# EAGLE schematic LPC_4TE_TOP_3_53c (EAGLE 5.04)

## Sheet 1 of 2
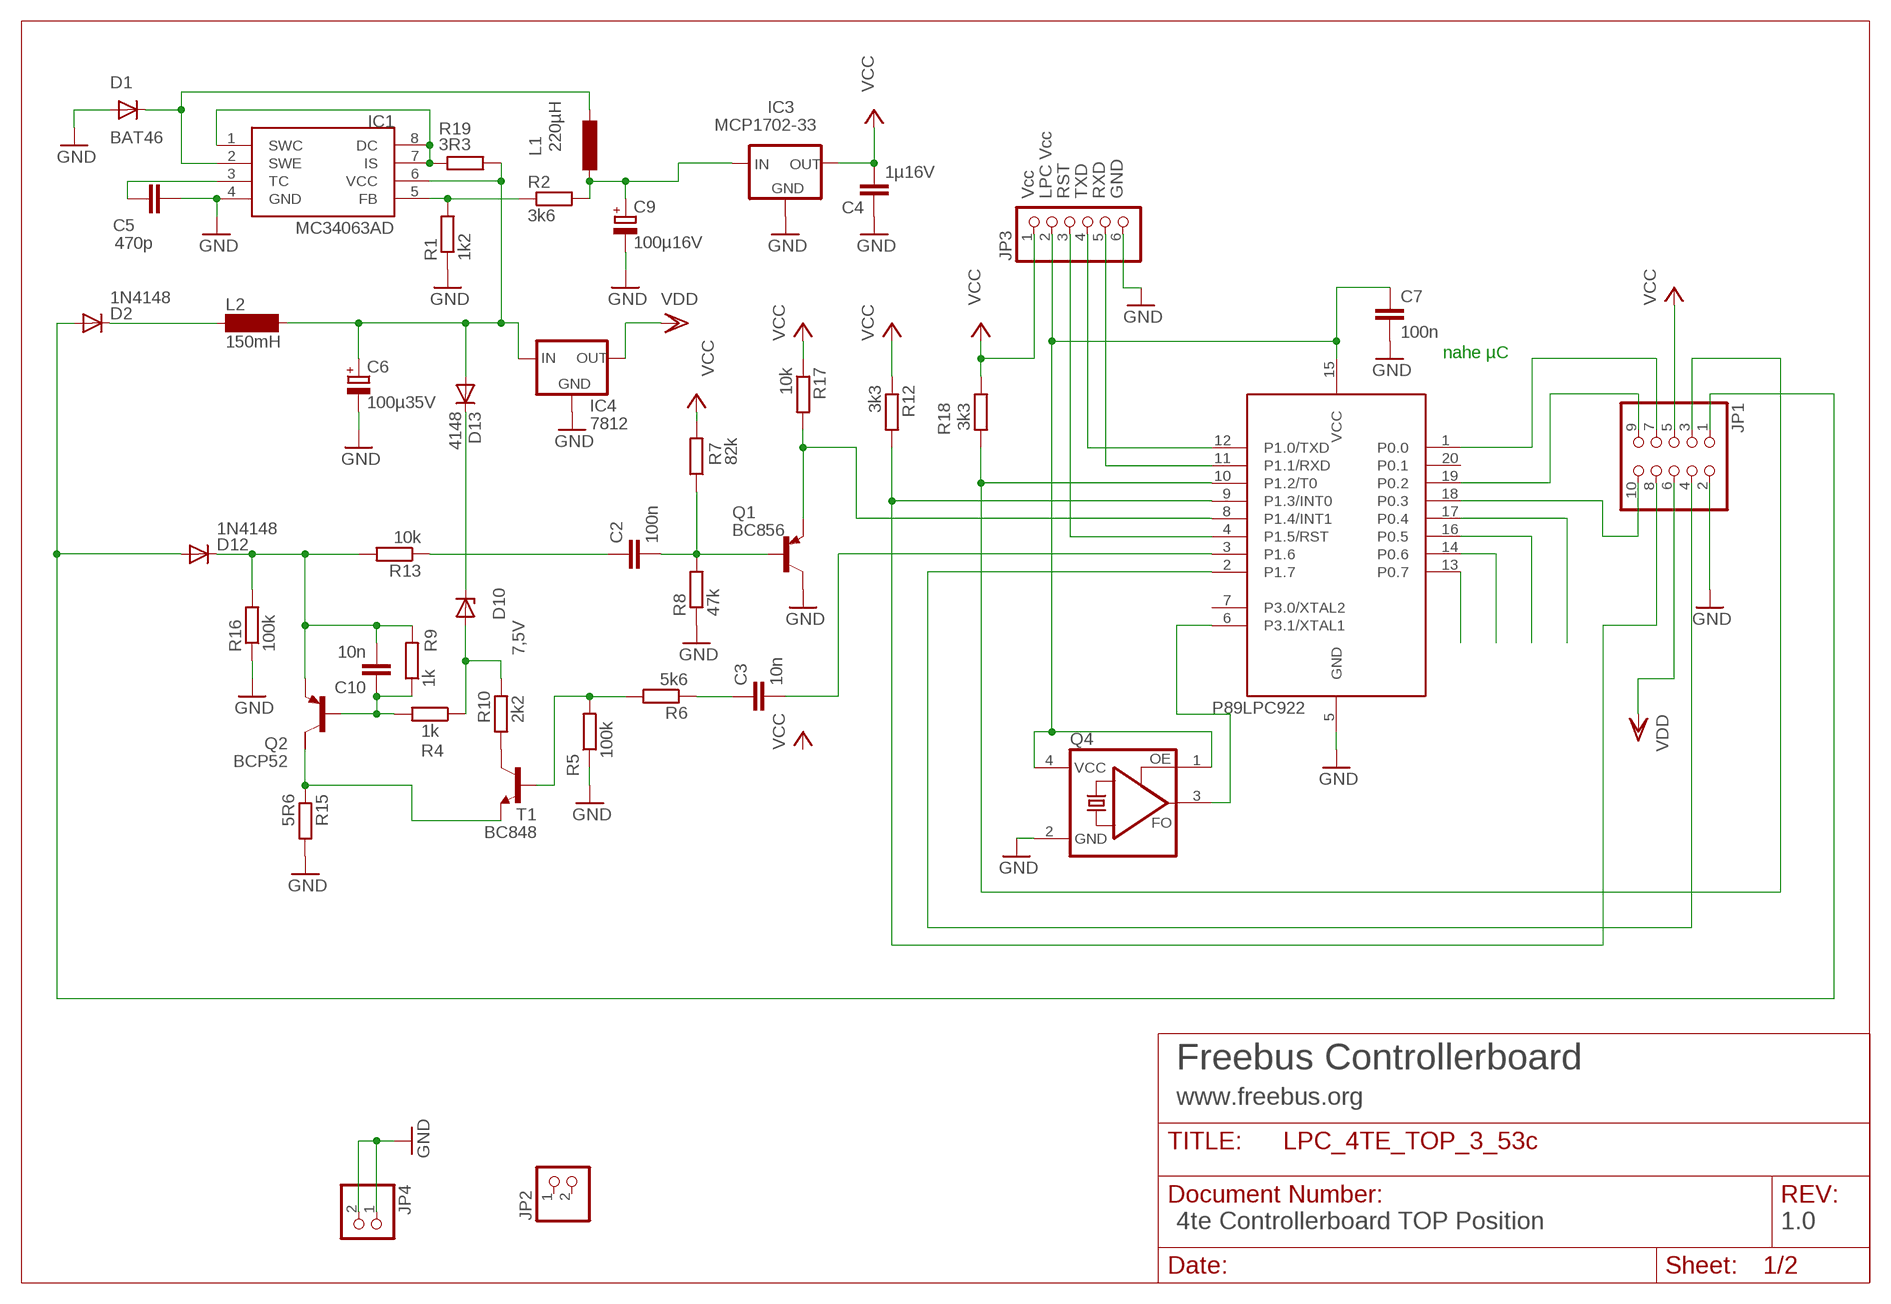
[diagram p0: schematic, sheet 1]

### Parts
C2  100n  C-EUC1206  [C1206]
C3  10n  C-EUC1206  [C1206]
C4  1µ16V  C-EUC1206  [C1206]
C5  470p  C-EUC1206  [C1206]
C6  100µ35V  CPOL-EUE5-8.5  [E5-8,5]
C7  100n  C-EUC1206  [C1206]
C9  100µ16V  CPOL-EUE2.5-5  [E2,5-5]
C10  10n  C-EUC1206  [C1206]
D1  BAT46  DIODE-MINIMELF  [MINIMELF]
D2  1N4148  DIODE-MINIMELF  [MINIMELF]
D10  7,5V  ZPD  [MINIMELF]
D12  1N4148  DIODE-MINIMELF  [MINIMELF]
D13  4148  DIODE-MINIMELF  [MINIMELF]
IC1  MC34063AD  [SOIC8]
IC3  MCP1702-33  79LXX  [79LXX]
IC4  7812  78XXS  [78XXS]
JP1  PINHD-2X5  [2X05]
JP2  PINHD-1X2  [1X02]
JP3  PINHD-1X6  [1X06]
JP4  PINHD-1X2  [1X02]
L1  220µH  L-EU2200-11.43  [2200-11.43]
L2  150mH  SD12-1000  [SD12_1000]
Q1  BC856  BC856ALT1SMD  [SOT23-BEC]
Q2  BCP52  FZT753SMD  [SOT223]
Q4  ASFL  [ASF]
R1  1k2  R-EU_R1206  [R1206]
R2  3k6  R-EU_M1206  [M1206]
R4  1k  R-EU_R1206  [R1206]
R5  100k  R-EU_R1206  [R1206]
R6  5k6  R-EU_R1206  [R1206]
R7  82k  R-EU_R1206  [R1206]
R8  47k  R-EU_M1206  [M1206]
R9  1k  R-EU_R1206  [R1206]
R10  2k2  R-EU_M1206  [M1206]
R12  3k3  R-EU_R1206  [R1206]
R13  10k  R-EU_R1206  [R1206]
R15  5R6  R-EU_R1206  [R1206]
R16  100k  R-EU_M1206  [M1206]
R17  10k  R-EU_R1206  [R1206]
R18  3k3  R-EU_M1206  [M1206]
R19  3R3  R-EU_M1206  [M1206]
T1  BC848  [SOT23]
U1  89LPC922  [DIL20]

### Nets
DRAIN: R10.1 T1.3(C)
EIB+: D2.A D12.A JP1.1
EIB_DC: C6.+ D13.A IC1.6(VCC) IC4.IN L2.2 R19.2
EIB_SEND: C3.2 U1.3(P1.6)
EIBIN: Q1.E R17.2 U1.8(P1.4/INT1)
GATE: R5.2 R6.2 T1.1(B)
GND: C4.1 C5.2 C6.- C7.2 C9.- D1.A IC1.4(GND) IC3.GND IC4.GND JP1.2 JP3.6 JP4.1 JP4.2 Q1.C Q4.2(GND) R1.1 R5.1 R8.1 R15.2 R16.1 U1.5(GND) ; also sheet 2
INT0: JP1.8 R12.2 U1.9(P1.3/INT0)
N$4: C10.1 Q2.1(B) R4.2 R9.1
N$5: C3.1 R6.1
N$6: C10.2 D12.C Q2.3(E) R9.2 R13.2 R16.2
N$7: Q2.2(C) R15.1 T1.2(E)
N$8: D2.C L2.1
N$9: JP3.5 U1.11(P1.1/RXD)
N$12: C9.+ IC3.IN L1.1 R2.2
N$16: JP3.3 U1.4(P1.5/RST)
N$24: JP3.4 U1.12(P1.0/TXD)
N$25: Q4.3(FO) U1.6(P3.1/XTAL1)
N$31: C2.2 Q1.B R7.1 R8.2
N$50: IC1.5(FB) R1.2 R2.1
N$51: D1.C IC1.2(SWE) L1.2
N$52: C5.1 IC1.3(TC)
N$55: D10.A R4.1 R10.2
N$58: D10.C D13.C
N$63: IC1.1(SWC) IC1.7(IS) IC1.8(DC) R19.1
N$77: C2.1 R13.1
P0.0: JP1.7 U1.1(P0.0)
P0.2: JP1.9 U1.19(P0.2)
P0.3: JP1.10 U1.18(P0.3)
P04: U1.17(P0.4) ; also sheet 2
P05: U1.16(P0.5) ; also sheet 2
P06: U1.14(P0.6) ; also sheet 2
P07: U1.13(P0.7)
PROG: JP1.4 U1.2(P1.7)
PWM: JP1.3 R18.2 U1.10(P1.2/T0)
VCC: C4.2 IC3.OUT JP1.5 JP3.1 R7.2 R12.1 R17.1 R18.1 ; also sheet 2
VCC_LPC: C7.1 JP3.2 Q4.1(OE) Q4.4(VCC) U1.15(VCC)
VDD: IC4.OUT JP1.6
Unconnected: JP2.1 JP2.2 Q2.4(C/) U1.7(P3.0/XTAL2) U1.20(P0.1)

### Notes on the sheet
- Vcc | LPC Vcc | RST | TXD | RXD | GND
- nahe µC
- P89LPC922
- Freebus Controllerboard
- www.freebus.org
- 4te Controllerboard TOP Position | 1.0

## Sheet 2 of 2
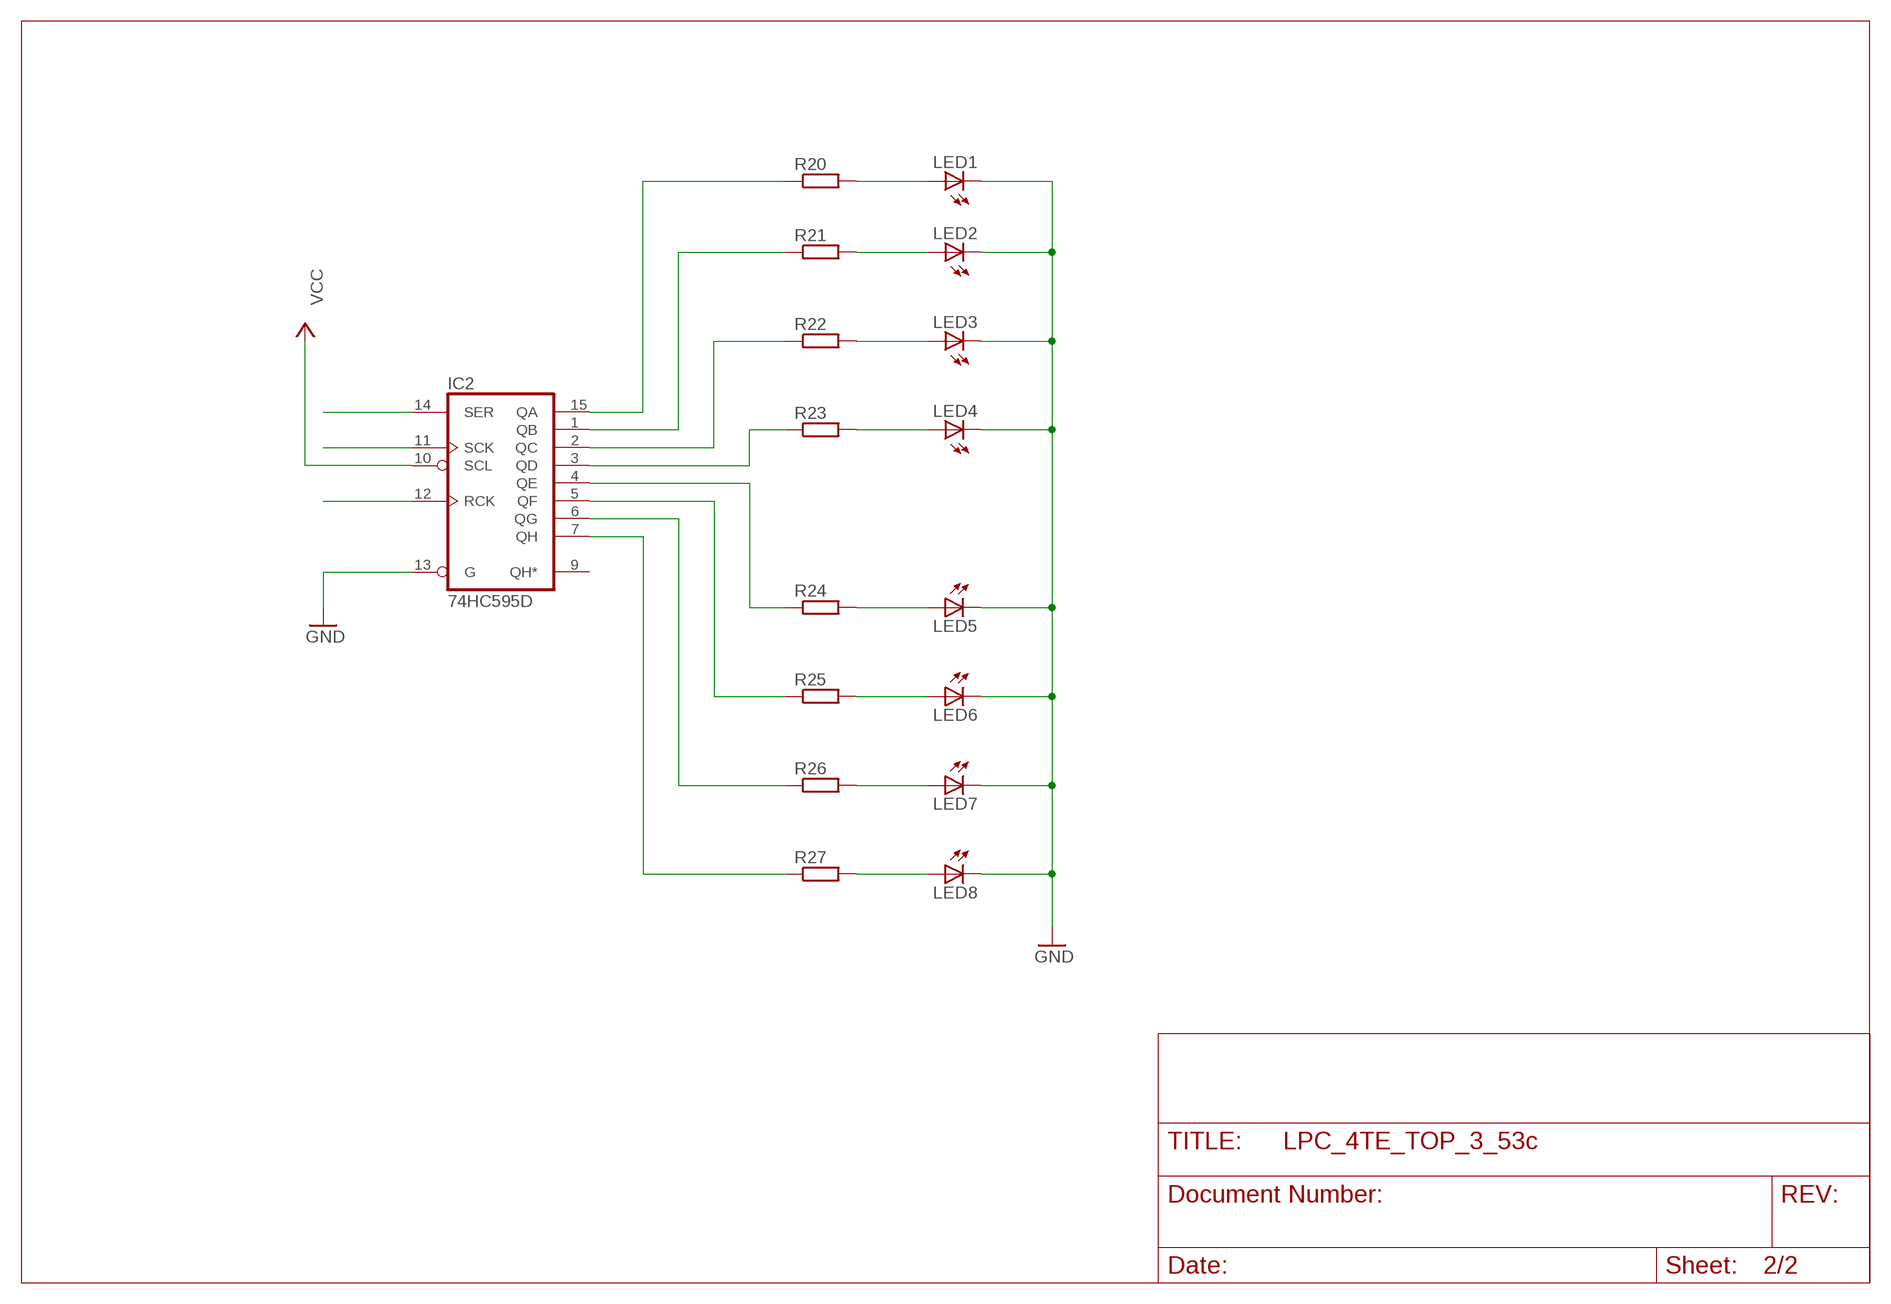
[diagram p1: schematic, sheet 2]

### Parts
IC2  74HC595D  [SO16]
LED1  LED3MM  [LED3MM]
LED2  LED3MM  [LED3MM]
LED3  LED3MM  [LED3MM]
LED4  LED3MM  [LED3MM]
LED5  LED3MM  [LED3MM]
LED6  LED3MM  [LED3MM]
LED7  LED3MM  [LED3MM]
LED8  LED3MM  [LED3MM]
R20  R-EU_R1206  [R1206]
R21  R-EU_R1206  [R1206]
R22  R-EU_R1206  [R1206]
R23  R-EU_R1206  [R1206]
R24  R-EU_R1206  [R1206]
R25  R-EU_R1206  [R1206]
R26  R-EU_R1206  [R1206]
R27  R-EU_R1206  [R1206]

### Nets
GND: IC2.13(G) LED1.K(C) LED2.K(C) LED3.K(C) LED4.K(C) LED5.K(C) LED6.K(C) LED7.K(C) LED8.K(C) ; also sheet 1
N$1: LED1.A R20.2
N$2: LED2.A R21.2
N$3: LED3.A R22.2
N$10: LED4.A R23.2
N$11: LED5.A R24.2
N$13: LED6.A R25.2
N$15: LED7.A R26.2
N$18: LED8.A R27.2
N$22: IC2.15(QA) R20.1
N$23: IC2.1(QB) R21.1
N$28: IC2.2(QC) R22.1
N$29: IC2.3(QD) R23.1
N$30: IC2.7(QH) R27.1
N$32: IC2.6(QG) R26.1
N$33: IC2.5(QF) R25.1
N$34: IC2.4(QE) R24.1
P04: IC2.14(SER) ; also sheet 1
P05: IC2.11(SCK) ; also sheet 1
P06: IC2.12(RCK) ; also sheet 1
VCC: IC2.10(SCL) ; also sheet 1
Unconnected: IC2.9(QH*)

## Power pins joined to a net without a drawn wire
GND: IC2.8(GND)
VCC: IC2.16(VCC)

## Library data of the parts
C2-C5 C7 C10 = rcl:C-EU: CAPACITOR, European symbol
C6 C9 = rcl:CPOL-EU: POLARIZED CAPACITOR, European symbol
D1 D2 D12 D13 = diode:DIODE-: DIODE
D10 = diode:ZPD: Z DIODE 500 mW
IC1 = mc34063:MC34063
IC2 = 74xx-eu:74*595: 8-bit SHIFT REGISTER, output latch
IC3 = v-reg:79LXX: VOLTAGE REGULATOR
IC4 = v-reg:78XXS: VOLTAGE REGULATOR
JP1 = pinhead:PINHD-2X5: PIN HEADER
JP2 JP4 = pinhead:PINHD-1X2: PIN HEADER
JP3 = pinhead:PINHD-1X6: PIN HEADER
L1 = rcl:L-EU: INDUCTOR, European symbol
L2 = inductor-neosid:SD12: INDUCTOR nominal inductance
LED1-LED8 = led:LED: LED OSRAM: - CHIPLED LG R971, LG N971, LY N971, LG Q971, LY Q971, LO R971, LY R971 LH N974, LH R974 LS Q976, LO Q976, LY Q976 LO Q996 - Hyper CHIPLED LW Q18S LB Q993, LB Q99A, LB R99A - SideLED LS A670, LO A670, LY A670, LG A670, LP A670 LB A673, LV A673, LT A673, LW A673 LH A674 LY A675 LS A676, LA A676, LO A676, LY A676, LW A676 LS A679, LY A679, LG A679 - Hyper Micro SIDELED® LS Y876, LA Y876, LO Y876, LY Y876 LT Y87S - SmartLED LW L88C, LW L88S LB L89C, LB L89S, LG L890 LS L89K, LO L89K, LY L89K LS L896, LA L896, LO L896, LY L896 - TOPLED LS T670, LO T670, LY T670, LG T670, LP T670 LSG T670, LSP T670, LSY T670, LOP T670, LYG T670 LG T671, LOG T671, LSG T671 LB T673, LV T673, LT T673, LW T673 LH T674 LS T676, LA T676, LO T676, LY T676, LB T676, LH T676, LSB T676, LW T676 LB T67C, LV T67C, LT T67C, LS T67K, LO T67K, LY T67K, LW E67C LS E67B, LA E67B, LO E67B, LY E67B, LB E67C, LV E67C, LT E67C LW T67C LS T679, LY T679, LG T679 LS T770, LO T770, LY T770, LG T770, LP T770 LB T773, LV T773, LT T773, LW T773 LH T774 LS E675, LA E675, LY E675, LS T675 LS T776, LA T776, LO T776, LY T776, LB T776 LHGB T686 LT T68C, LB T68C - Hyper Mini TOPLED® LB M676 - Mini TOPLED Santana® LG M470 LS M47K, LO M47K, LY M47K Source: http://www.osram.convergy.de - LUMILED® LXK2-PW12-R00, LXK2-PW12-S00, LXK2-PW14-U00, LXK2-PW14-V00 LXK2-PM12-R00, LXK2-PM12-S00, LXK2-PM14-U00 LXK2-PE12-Q00, LXK2-PE12-R00, LXK2-PE12-S00, LXK2-PE14-T00, LXK2-PE14-U00 LXK2-PB12-K00, LXK2-PB12-L00, LXK2-PB12-M00, LXK2-PB14-N00, LXK2-PB14-P00, LXK2-PB14-Q00 LXK2-PR12-L00, LXK2-PR12-M00, LXK2-PR14-Q00, LXK2-PR14-R00 LXK2-PD12-Q00, LXK2-PD12-R00, LXK2-PD12-S00 LXK2-PH12-R00, LXK2-PH12-S00 LXK2-PL12-P00, LXK2-PL12-Q00, LXK2-PL12-R00 Source: www.luxeon.com
Q1 = transistor-pnp:BC856*: PNP Transistror
Q2 = transistor-pnp:FZT753SMD: PNP Transistor
Q4 = crystal:ASF*: CRYSTAL CLOCK OSCILLATORS 5.0 Vdc or 3.3 Vdc - LOW PROFILE ULTRA MINIATURE CERAMIC SURFACE MOUNT Source: http://www.abracon.com/Oscillators/asf1-L-L1.pdf
R1 R2 R4-R10 R12 R13 R15-R27 = rcl:R-EU_: RESISTOR, European symbol
T1 = transistor:BC848: NPN TRANSISTOR
U1 = micro-philips:89LPC922